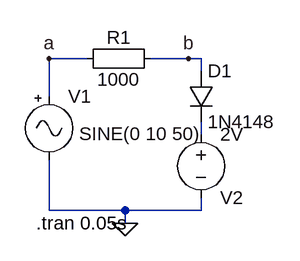
[diagram p0: schematic limiter_diod_reg.asc]
limiter_diod_reg.asc, the LTspice schematic file:
Version 4
SHEET 1 880 680
WIRE 0 144 -48 144
WIRE 128 144 80 144
WIRE 144 144 128 144
WIRE 144 160 144 144
WIRE -48 192 -48 144
WIRE 144 240 144 224
WIRE -48 336 -48 272
WIRE 48 336 -48 336
WIRE 144 336 144 320
WIRE 144 336 48 336
WIRE 48 352 48 336
FLAG -48 144 a
FLAG 128 144 b
FLAG 48 352 0
SYMBOL diode 128 160 R0
SYMATTR Value 1N4148
SYMATTR InstName D1
SYMBOL Misc\\signal -48 176 R0
WINDOW 123 0 0 Left 2
WINDOW 39 0 0 Left 2
WINDOW 3 38 63 Left 2
SYMATTR Value SINE(0 10 50)
SYMATTR InstName V1
SYMBOL Misc\\EuropeanResistor 96 128 R90
WINDOW 0 5 56 VBottom 2
WINDOW 3 27 56 VTop 2
SYMATTR InstName R1
SYMATTR Value 1000
SYMBOL voltage 144 224 R0
WINDOW 0 24 96 Left 2
WINDOW 3 24 16 Left 2
WINDOW 123 0 0 Left 0
WINDOW 39 0 0 Left 0
SYMATTR InstName V2
SYMATTR Value 2V
TEXT -64 352 Left 2 !.tran 0.05s

The netlist it stands for:
* limiter_diod_reg.asc
D1 b N001 1N4148
V1 a 0 SINE(0 10 50)
R1 b a 1000
V2 N001 0 2V
.model D D
.lib standard.dio
.tran 0.05s
.backanno
.end